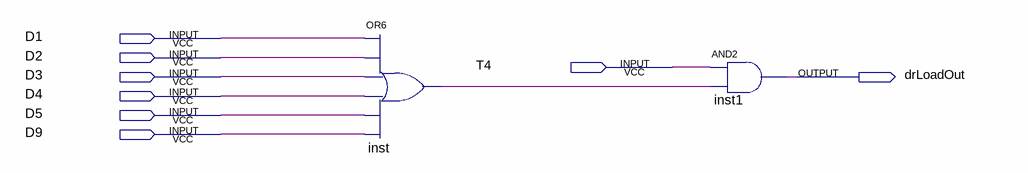
[diagram p0: schematic sheet]
// Quartus schematic drLoad.bdf as structural Verilog: 2 symbols, 8 pins
module drLoad (
  input  D1,
  input  D2,
  input  T4,
  input  D3,
  input  D4,
  input  D5,
  input  D9,
  output drLoadOut
);

  wire inst_out;

  or inst (inst_out, D1, D2, D3, D4, D5, D9);
  and inst1 (drLoadOut, T4, inst_out);
endmodule
